# Altium schematic sheet Connector_LV.SchDoc: Connector and power protection
size A3; Organization: ORGANIZATION; Address1: ADDRESS 1; Address2: ADDRESS 2; Address3: ADDRESS 3; Address4: ADDRESS 4; Revision: 0.0; SheetNumber: 19; SheetTotal: 19; ENG_APP_DATE: --/--/--; DSN_APP_DATE: --/--/--; CHK_APP_DATE: --/--/--
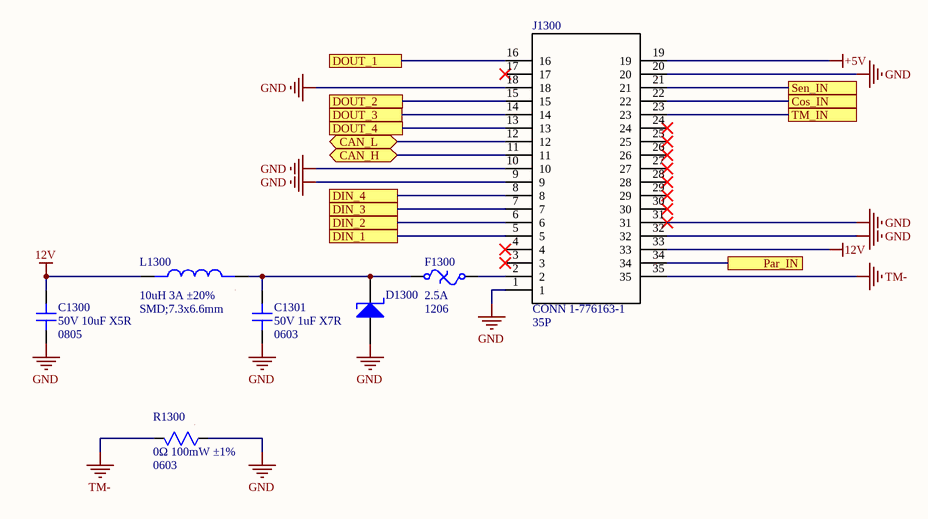
[diagram p0: Connector_LV.SchDoc]

## Parts
C1300  value 50V 10uF X5R  Package: 0805  [CAP SMD 0805]  (hidden comment: CAP non polarized)
C1301  value 50V 1uF X7R  Package: 0603  [CAP SMD 0603]  (hidden comment: CAP non polarized)
D1300  DIODE SCHOTTKY  [DO-214AB]  (value not drawn)
F1300  value 2.5A  Package: 1206  [FUSE SMD 1206]  (hidden comment: FUSE)
J1300  CONN 1-776163-1  value 35P  [1-776163-1]
L1300  value 10uH 3A ±20%  Package: SMD;7.3x6.6mm  [IND SMD 7.3x6.6]  (hidden comment: IND)
R1300  value 0Ω 100mW ±1%  Package: 0603  [RES SMD 0603]  (hidden comment: RES)

## Ports
CAN_H (bidir), CAN_L (bidir), Cos_IN, DIN_1, DIN_2, DIN_3, DIN_4, DOUT_1, DOUT_2, DOUT_3, DOUT_4, Par_IN, Sen_IN, TM_IN

## Nets
12V: C1300.1 J1300.33 L1300.1
+5V: J1300.19
GND: C1300.2 C1301.2 D1300.A J1300.1 J1300.9 J1300.10 J1300.18 J1300.20 J1300.31 J1300.32 R1300.1
TM-: J1300.35 R1300.2
CAN_H: J1300.11 ; port CAN_H
CAN_L: J1300.12 ; port CAN_L
Cos_IN: J1300.22 ; port Cos_IN
DIN_1: J1300.5 ; port DIN_1
DIN_2: J1300.6 ; port DIN_2
DIN_3: J1300.7 ; port DIN_3
DIN_4: J1300.8 ; port DIN_4
DOUT_1: J1300.16 ; port DOUT_1
DOUT_2: J1300.15 ; port DOUT_2
DOUT_3: J1300.14 ; port DOUT_3
DOUT_4: J1300.13 ; port DOUT_4
Par_IN: J1300.34 ; port Par_IN
Sen_IN: J1300.21 ; port Sen_IN
TM_IN: J1300.23 ; port TM_IN
NetC1301_1: C1301.1 D1300.K F1300.1 L1300.2
NetF1300_2: F1300.2 J1300.2

Not connected (* = marked no-connect by the designer): J1300 3* 4* 17* 24* 25* 26* 27* 28* 29* 30*

## Notes on the sheet
- Project:
- Subsystem:
- Company:
- Document:
- Author:
- Revision:
- Date:
- Sheet:
- /

## Library data of the parts
C1300 = 001-0123: Condensadores de cerámica multicapa (MLCC- SMD/SMT) 10 uF 50 VDC 10% 0805 X5R; MPN: GRM21BR61H106KE43K; Manufacturer: muRata; ComponentLink1Description: Datasheet; ComponentLink1URL: https://www.mouser.es/datasheet/3/76/1/GRM21BR61H106KE43_01A.pdf; ComponentLink2Description: Distributor Link; ComponentLink2URL: https://www.mouser.es/ProductDetail/Murata-Electronics/GRM21BR61H106KE43K?qs=xZ%2FP%252Ba9zWqbh3%252B96jyTKxw%3D%3D; ID: 001-0123; Distributor PN: 81-GRM21BR61H106KE3K; Distributor: Mouser
C1301 = 001-0102: Condensadores de cerámica multicapa (MLCC- SMD/SMT) WCAP-CSGP 1uF 50 Vol 10%; MPN: 885012206126; Manufacturer: Wurth Elektronik; ComponentLink1Description: Datasheet; ComponentLink1URL: https://www.we-online.com/components/products/datasheet/885012206126.pdf; ComponentLink2Description: Distributor Link; ComponentLink2URL: https://www.mouser.es/ProductDetail/Wurth-Elektronik/885012206126?qs=amGC7iS6iy%2F%252BJOLb%2FSuwig%3D%3D; ID: 001-0102; Distributor PN: 710-885012206126; Distributor: Mouser
D1300 = 031-0013: Diodos y rectificadores Schottky 3A 60V; MPN: MBRS360T3G; Manufacturer: onsemi; Value: 60V 3A; ComponentLink1Description: Datasheet; ComponentLink1URL: https://www.onsemi.com/pdf/datasheet/mbrs360t3-d.pdf; ComponentLink2Description: Distributor Link; ComponentLink2URL: https://www.mouser.es/ProductDetail/onsemi/MBRS360T3G?qs=3JMERSakebpuPnGIg0cvPA%3D%3D; ID: 031-0013; Package: DO-214AB; Distributor PN: 863-MBRS360T3G; Distributor: Mouser
F1300 = 040-0021: Fusibles de montaje en superficie 2.5A Fast Acting 1206 SinglFuse; MPN: SF-1206F250-2; Manufacturer: Bourns; ComponentLink1Description: Datasheet; ComponentLink1URL: https://www.mouser.es/datasheet/3/40/1/sf_1206f48eb4f2c90e165f58a72ff000066632f.pdf; ComponentLink2Description: Distributor Link; ComponentLink2URL: https://www.mouser.es/ProductDetail/Bourns/SF-1206F250-2?qs=GIQXYiEeHGDcWHFyUr2UTQ%3D%3D; ID: 040-0021; Distributor PN: 652-SF-1206F250-2; Distributor: Mouser
J1300 = 110-0065: Conectores para automoción 35P HEADER AMPSEAL ASSEMBLY; Manufacturer: TE Connectivity; ComponentLink1Description: Datasheet; ComponentLink1URL: https://www.mouser.es/datasheet/3/80/26/ENG_CD_776163_K1.pdf; ComponentLink2Description: Distributor Link; ComponentLink2URL: https://www.mouser.es/ProductDetail/TE-Connectivity-AMP/1-776163-1?qs=VKrXD49J9EqcsUPRwW8PqQ%3D%3D; ID: 110-0065; Package: THT 4mm; MPN: 1-776163-1; Distributor PN: 571-1-776163-1; Distributor: Mouser
L1300 = 020-0003: Inductores de potencia (SMD) WE-LHMI Powr SMD7030 10uH 3.0A 85mOhm; MPN: 74437346100; Manufacturer: Wurth Elektronik; ComponentLink1Description: Datasheet; ComponentLink1URL: https://www.we-online.com/components/products/datasheet/74437346100.pdf; ComponentLink2Description: Distributor Link; ComponentLink2URL: https://www.mouser.es/ProductDetail/Wurth-Elektronik/74437346100?qs=cFlH0mFHHFqNHncV%252BuVFvQ%3D%3D; ID: 020-0003; Distributor PN: 710-74437346100; Distributor: Mouser
R1300 = 010-0160: Resistores de película gruesa - SMD WRIS-RSKS <0.05 Ohms 0.1 W Jumper 0603 AEC-Q200; MPN: 560112116001; Manufacturer: Wurth Elektronik; ComponentLink1Description: Datasheet; ComponentLink1URL: https://www.we-online.com/components/products/datasheet/560112116001.pdf; ComponentLink2Description: Distributor Link; ComponentLink2URL: https://www.mouser.es/ProductDetail/Wurth-Elektronik/560112116001?qs=mELouGlnn3dlnHYj7TecuA%3D%3D; ID: 010-0160; Distributor PN: 710-560112116001; Distributor: Mouser